# Altium schematic sheet USB Sheet (FT232RL).SchDoc
size A4
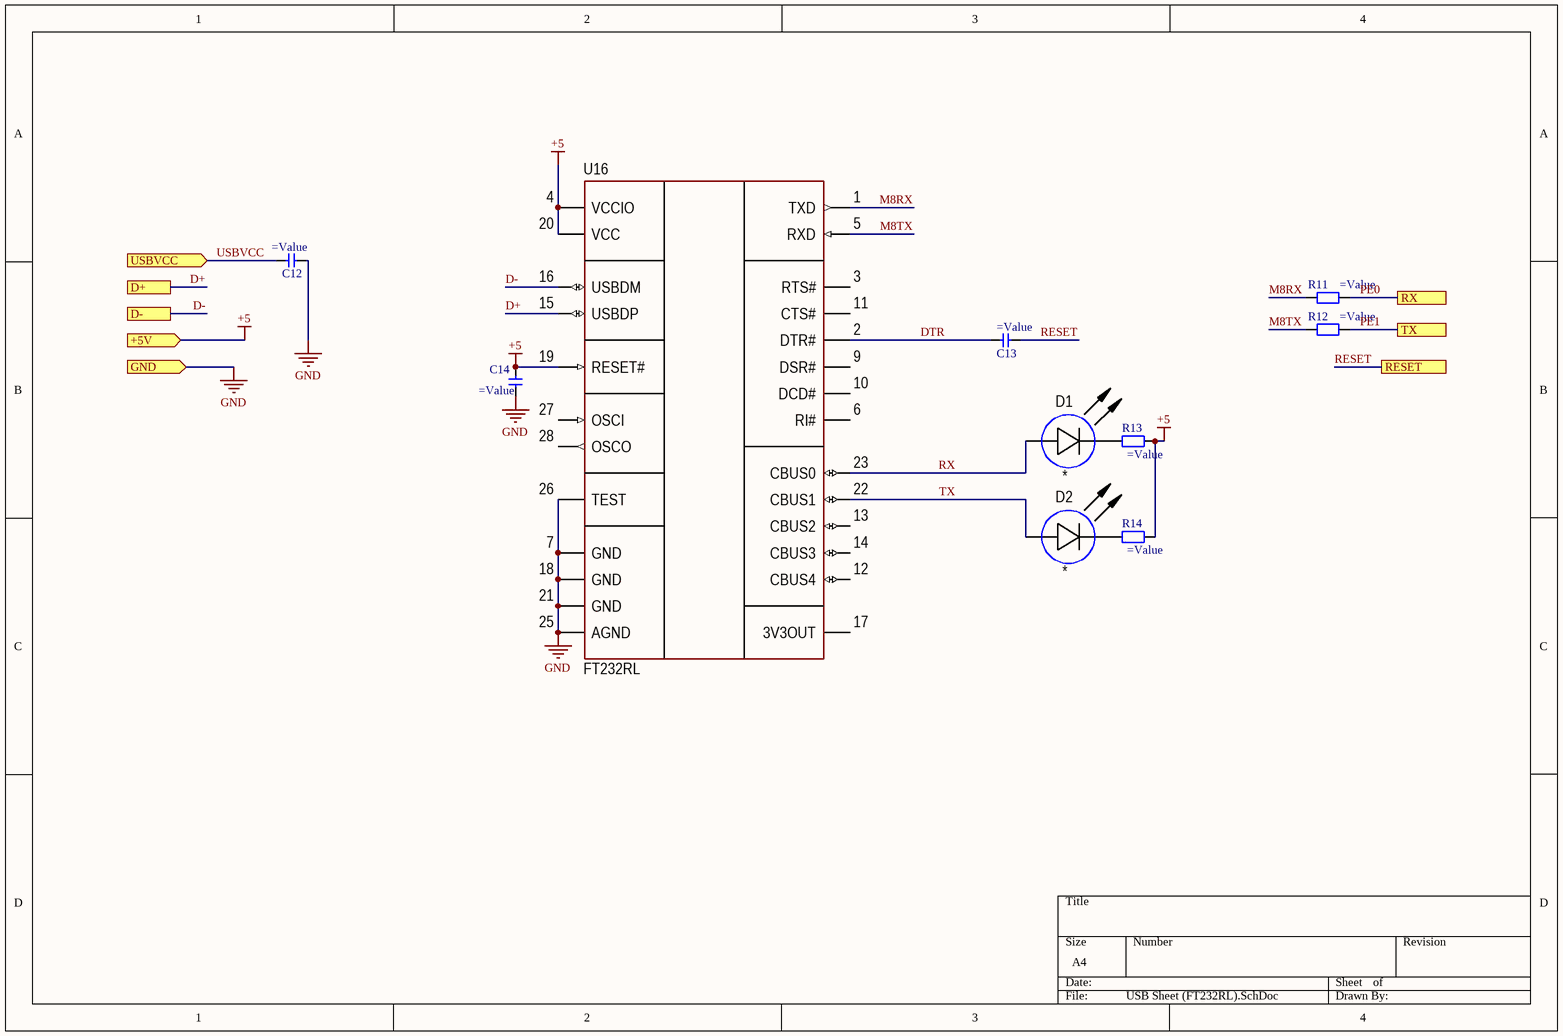
[diagram p0: USB Sheet (FT232RL).SchDoc]

## Parts
C12  (no value)  [cap0603]
C13  (no value)  [cap0603]
C14  (no value)  [cap0603]
D1  *  [CH0603LB]
D2  *  [CH0603LB]
R11  (no value)  [res0603]
R12  (no value)  [res0603]
R13  (no value)  [res0603]
R14  (no value)  [res0603]
U16  FT232RL  [28-SSOP]

## Ports
+5V (in), D+, D-, GND (in), RESET, RX, TX, USBVCC (in)

## Nets
+5: C14.2 R13.2 R14.2 U16.4(VCCIO) U16.19(RESET#) U16.20(VCC) ; port +5V
GND: C12.2 C14.1 U16.7(GND) U16.18(GND) U16.21(GND) U16.25(AGND) U16.26(TEST) ; port GND
D+: U16.15(USBDP) ; port D+
D-: U16.16(USBDM) ; port D-
DTR: C13.1 U16.2(DTR#)
M8RX: R11.1 U16.1(TXD)
M8TX: R12.1 U16.5(RXD)
PE0: R11.2 ; port RX
PE1: R12.2 ; port TX
RESET: C13.2 ; port RESET
RX: D1.1(A) U16.23(CBUS0)
TX: D2.1(A) U16.22(CBUS1)
USBVCC: C12.1 ; port USBVCC
NetD1_2: D1.2(C) R13.1
NetD2_2: D2.2(C) R14.1

Not connected (* = marked no-connect by the designer): U16 3(RTS#) 6(RI#) 9(DSR#) 10(DCD#) 11(CTS#) 12(CBUS4) 13(CBUS2) 14(CBUS3) 17(3V3OUT) 27(OSCI) 28(OSCO)

## Library data of the parts
C12-C14 = Cap SMD
D1 D2 = LED: Manufacturer: *; Model: *; HelpURL: *; ComponentKind: *; Value: *
R11-R14 = Resistor SMD
U16 = FT232RL: USB-UART; Manufacturer: FTDI, Future Technology Devices International Ltd; Model: FT232RL-REEL; HelpURL: https://www.digikey.com/product-detail/en/ftdi-future-technology-devices-international-ltd/FT232RL-REEL/768-1007-1-ND/1836402; ComponentKind: SSOP-28